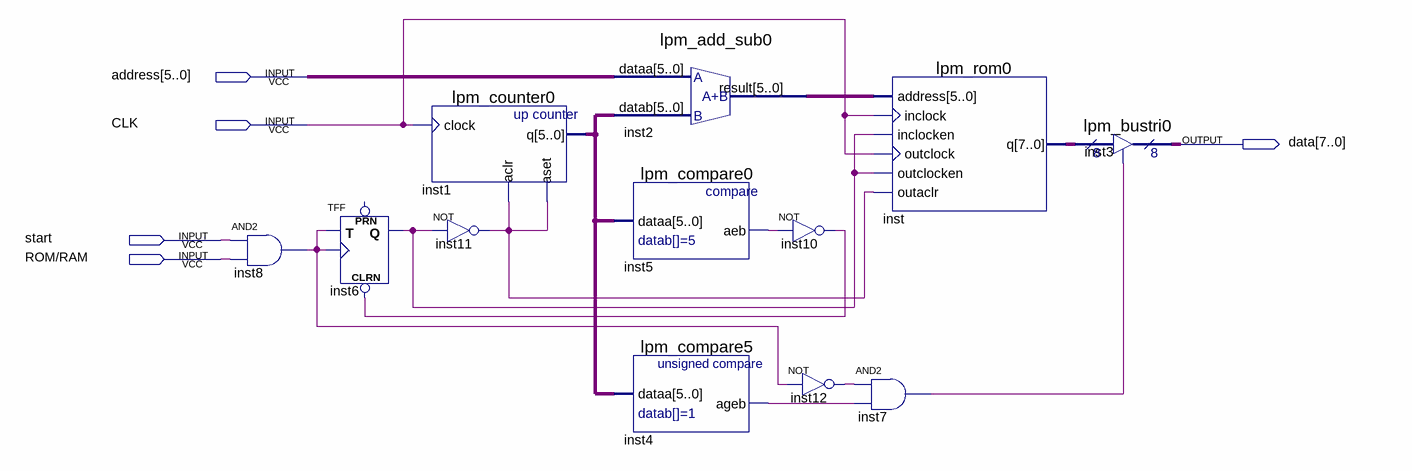
[diagram p0: schematic sheet]
// Quartus schematic ROM.bdf as structural Verilog: 12 symbols, 5 pins
module ROM (
  input  [5:0] address,
  input  CLK,
  input  start,
  input  \ROM/RAM ,
  output [7:0] data
);

  wire inst4_ageb, inst5_aeb, inst6_q, inst7_out, inst8_out, inst10_out, inst11_out, inst12_out;
  wire [5:0] inst1_q, inst2_result;
  wire [7:0] inst_q;

  and inst8 (inst8_out, start, \ROM/RAM );
  TFF inst6 (.CLRN(inst10_out), .T(inst8_out), .CLK(inst8_out), .Q(inst6_q));  // open: PRN
  lpm_counter0 inst1 (.clock(CLK), .aclr(inst11_out), .aset(inst11_out), .q(inst1_q));
  not inst11 (inst11_out, inst6_q);
  lpm_add_sub0 inst2 (.dataa(address), .datab(inst1_q), .result(inst2_result));
  lpm_compare0 inst5 (.dataa(inst1_q), .aeb(inst5_aeb));
  lpm_compare5 inst4 (.dataa(inst1_q), .ageb(inst4_ageb));
  not inst10 (inst10_out, inst5_aeb);
  not inst12 (inst12_out, inst8_out);
  lpm_rom0 inst (
    .address(inst2_result), .inclock(CLK), .inclocken(inst6_q), .outclock(CLK), .outclocken(inst6_q),
    .outaclr(inst11_out), .q(inst_q));
  and inst7 (inst7_out, inst12_out, inst4_ageb);
  lpm_bustri0 inst3 (.enabledt(inst7_out), .data(inst_q), .tridata(data));
endmodule
